# Altium schematic sheet battery_charger.SchDoc
size 297 x 209 mm; DrawnBy: Supun; Engineer: Supun; Organization: C3
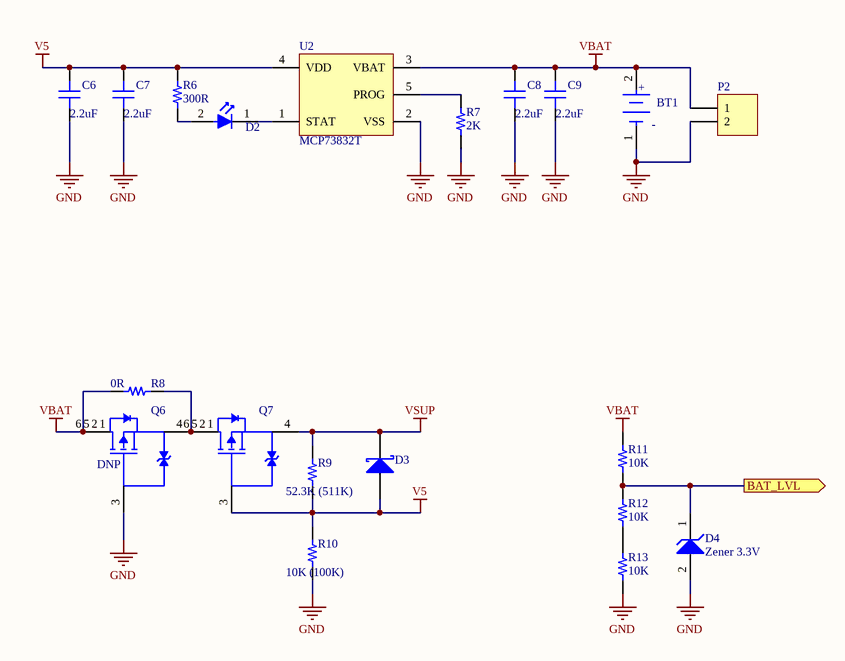
[diagram p0: battery_charger.SchDoc]

## Parts
BT1  18650_battery_holder  [Keystone_1043_0]  (value not drawn)
C6  2.2uF  [CAP 0603_1608]
C7  2.2uF  [CAP 0603_1608]
C8  2.2uF  [CAP 0603_1608]
C9  2.2uF  [CAP 0603_1608]
D2  Red  [Würth_Elektronik_0_MFG]  (value not drawn)
D3  *  [Rohm_TUMD2M_MFG]  (value not drawn)
D4  Zener 3.3V  [Diodes_SOD-123_0]
P2  DNP  [HDR1X2]  (value not drawn)
Q6  DNP  [Diodes_Inc._TSOT26_MFG]
Q7  P Mosfet  [Diodes_Inc._TSOT26_MFG]  (value not drawn)
R6  300R  [RES 0603_1608]
R7  2K  [RES 0603_1608]
R8  0R  [RES 0603_1608]
R9  52.3K (511K)  [RES 0603_1608]
R10  10K (100K)  [RES 0603_1608]
R11  10K  [RES 0603_1608]
R12  10K  [RES 0603_1608]
R13  10K  [RES 0603_1608]
U2  MCP73832T  [MICROCHIP SOT-23-5 OT]

## Ports
BAT_LVL (out)

## Nets
GND: BT1.1(C) C6.2 C7.2 C8.2 C9.2 D4.2(A) P2.2 Q6.3(G) R7.2 R10.2 R13.2 U2.2(VSS)
V5: C6.1 C7.1 D3.2(A) Q7.3(G) R6.2 R9.2 R10.1 U2.4(VDD)
VBAT: BT1.2(A) C8.1 C9.1 P2.1 Q6.1(D) Q6.2(D) Q6.5(D) Q6.6(D) R8.1 R11.1 U2.3(VBAT)
VSUP: D3.1(K) Q7.4(S) R9.1
BAT_LVL: D4.1(K) R11.2 R12.1 ; port BAT_LVL
NetD2_1: D2.1(C) U2.1(STAT)
NetD2_2: D2.2(A) R6.1
NetQ6_4: Q6.4(S) Q7.1(D) Q7.2(D) Q7.5(D) Q7.6(D) R8.2
NetR7_1: R7.1 U2.5(PROG)
NetR12_2: R12.2 R13.1

## Notes on the sheet
- Title
- Size:
- Date:
- A4
- Number:
- Time:
- Revision:
- Sheet
- of
- File:
- (in symbol 18650_battery_holder) +; -

## Library data of the parts
BT1 = 18650_battery_holder: Batt Holder 18650 1 Cell; MF: *; MP: *; Value: *
C6-C9 = Capacitor: SMT Capacitor; MF: Samsung; MP: CL10A225KP8NNNC; Value: 2.2uF; Link: https://www.mouser.com/ProductDetail/Samsung-Electro-Mechanics/CL10A225KP8NNNC?qs=hqM3L16%252Bxldb5UYUGQVB5Q%3D%3D
D2 = LED SMD: Led Diffused SMD; MF: LiteOn; MP: LTST-C190KRKT; Value: Red; Link: https://www.mouser.com/ProductDetail/Lite-On/LTST-C190KRKT?qs=kAD5fFa1n5VY3YYNWPC1Fg%3D%3D
D3 = Schottky Diode: Schottky Barrier Rectifier, 40 V Maximum DC Blocking Voltage, -65 to 125 degC, 2-Pin SMA Case, RoHS; MF: Toshiba; MP: CUHS20F30,H3F; ComponentLink1Description: Manufacturer URL; ComponentLink2Description: Datasheet; ComponentLink3URL: http://www.vishay.com/docs/88746/ss12.pdf; ComponentLink3Description: Package Specification; ComponentLink1URL: http://www.vishay.com/; ComponentLink2URL: http://www.vishay.com/docs/88746/ss12.pdf; Value: *; Link: https://www.mouser.com/ProductDetail/Toshiba/CUHS20F30H3F?qs=PqoDHHvF6497%2FIoWy79A3w%3D%3D
D4 = Zener Diode: Zener Voltage Regulator; Manufacturer: On Semiconductor; Packing: Tape and Reel; P Max (W): 0.5; VZ Typ (V): 4.7; MF: Onsemi; MP: MMSZ5226BT1G; ComponentLink1Description: Manufacturer URL; ComponentLink2Description: Datasheet; DatasheetVersion: Rev. 12; ComponentLink3URL: http://www.onsemi.com/pub_link/Collateral/425-04.PDF; ComponentLink3Description: Package Specification; ComponentLink1URL: http://www.onsemi.com/; ComponentLink2URL: http://www.onsemi.com/pub_link/Collateral/MMSZ5221BT1-D.PDF; PackageVersion: Rev. G, 10/2009; PackageReference: SOD-123-2-425-04; PackageDescription: 2-Pin SOD, Body 1.6 x 2.69 mm; Mounting Technology: Surface Mount; RoHS: Pb-Free; Value: Zener 3.3V; Link: https://www.mouser.com/ProductDetail/onsemi/MMSZ5226BT1G?qs=P4IOph%252Bbot%2Ft8yNxdh48XQ%3D%3D
P2 = Header 2: Header, 2-Pin; LatestRevisionDate: 17-Jul-2002; LatestRevisionNote: Re-released for DXP Platform.; Publisher: Altium Limited; Value: DNP; Link: https://
Q6 = Mosfet-P-6_ESD: P-Channel Enhancement Mode MOS Transistor, 3-Pin SOT23; MF: Vishay; MP: SI3421DV-T1-GE3; Value: P Mosfet; Link: https://www.mouser.com/ProductDetail/Vishay-Semiconductors/SI3421DV-T1-GE3?qs=dpt6vIvaxwjvmZPXyyVpRg%3D%3D
Q7 = Mosfet-P-6_ESD: P-Channel Enhancement Mode MOS Transistor, 3-Pin SOT23; MF: Vishay; MP: SI3421DV-T1-GE3; Value: P Mosfet; Link: https://www.mouser.com/ProductDetail/Vishay-Semiconductors/SI3421DV-T1-GE3?qs=dpt6vIvaxwjvmZPXyyVpRg%3D%3D
R6 = Resistor: SMT Resistor; MF: YAGEO; MP: AC0603FR-07300RL; Value: 300R; Link: https://www.mouser.com/ProductDetail/YAGEO/AC0603FR-07300RL?qs=yhV1fb9g%2FKYRCKndxB9juA%3D%3D
R7 = Resistor: SMT Resistor; MF: YAGEO; MP: AC0603FR-072KL; Value: 2K; Link: https://www.mouser.com/ProductDetail/YAGEO/AC0603FR-072KL?qs=ygRr%2FtkhtesLR2bjSRHyag%3D%3D
R8 = Resistor: SMT Resistor; MF: YAGEO; MP: AC0603FR-070RL; Value: 0R; Link: https://www.mouser.com/ProductDetail/YAGEO/AC0603FR-070RL?qs=UoPT7wUmgYIHE8YhvUntLg%3D%3D
R9 = Resistor: SMT Resistor; MF: YAGEO; MP: AC0603FR-0752K3L; Value: 52.3K; Link: https://www.mouser.com/ProductDetail/YAGEO/AC0603FR-0752K3L?qs=ygRr%2Ftkhtes52vQmIU4puQ%3D%3D
R10-R13 = Resistor: SMT Resistor; MF: YAGEO; MP: AC0603FR-0710KL; Value: 10K; Link: https://www.mouser.com/ProductDetail/YAGEO/AC0603FR-0710KL?qs=UoPT7wUmgYKz3zh0UDMA4Q%3D%3D
U2 = MCP73832T: Miniature Single-Cell, Fully Integrated Li-Ion, Li-Polymer Charge Management Controller, 4.2V, 5-Pin SOT-23, Industrial Temperature, Tape and Reel; PartNumber: MCP73832T-2DCI/OT; MF: Microchip; PackageDescription: 5-Lead Plastic Small Outline Transistor (OT) [SOT-23]; PackageVersion: revBB, Aug-2009; DatasheetVersion: revE, Sep-2008; Code_IPC: SOT23-5; PackageReference: SOT-23-OT5; MP: MCP73832T-2DCI/OT; Value: *; Link: https://www.mouser.com/ProductDetail/Microchip-Technology/MCP73832T-2DCI-OT?qs=yUQqVecv4quyMtCX903Btw%3D%3D